# EAGLE design CB77-EI-Conversion-V1 (EAGLE 6.5.0)
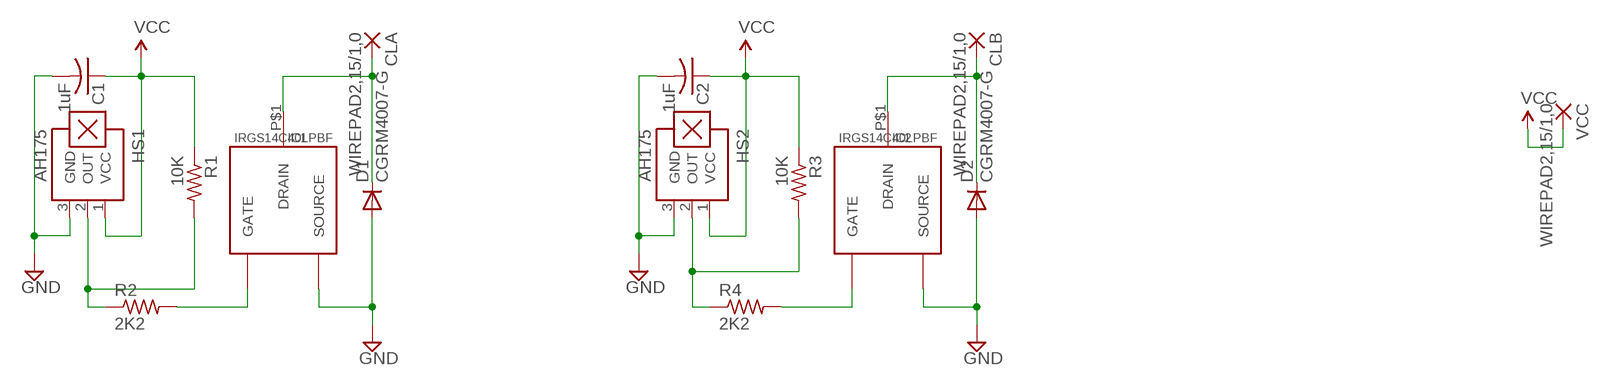
[diagram p0: schematic, sheet 1]

## Parts
C1  .1uF  C-USC0603K  [C0603K]
C2  .1uF  C-USC0603K  [C0603K]
CLA  WIREPAD2,15/1,0  [2,15/1,0]
CLB  WIREPAD2,15/1,0  [2,15/1,0]
D1  CGRM4007-G  [SOD-123_MINI-SMA]
D2  CGRM4007-G  [SOD-123_MINI-SMA]
HS1  AH175  A1301LH  [SOT23-W]
HS2  AH175  A1301LH  [SOT23-W]
IC1  IRGS14C40LPBF  [TO-263AB]
IC2  IRGS14C40LPBF  [TO-263AB]
R1  10K  R-US_R0603  [R0603]
R2  2K2  R-US_R0603  [R0603]
R3  10K  R-US_R0603  [R0603]
R4  2K2  R-US_R0603  [R0603]
VCC  WIREPAD2,15/1,0  [2,15/1,0]

## Nets
G1: IC1.P$2(GATE) R2.2
G2: IC2.P$2(GATE) R4.2
GND: C1.2 C2.2 D1.A D2.A HS1.3(GND) HS2.3(GND) IC1.P$3(SOURCE) IC2.P$3(SOURCE)
LHS: CLB.1(P) D2.C IC2.P$1(DRAIN)
N$3: HS1.2(OUT) R1.2 R2.1
N$8: HS2.2(OUT) R3.2 R4.1
RHS: CLA.1(P) D1.C IC1.P$1(DRAIN)
VCC: C1.1 C2.1 HS1.1(VCC) HS2.1(VCC) R1.1 R3.1 VCC.1(P)

## Library data of the parts
C1 C2 = adafruit:C-US: CAPACITOR, American symbol
CLA CLB VCC = wirepad:WIREPAD: Wire PAD connect wire on PCB
D1 D2 = diode:CGRM400*-G: Molded plasitc,JEDEC SOD-123/Mini SMA Source: Comchip CGRM4001-G.pdf
HS1 HS2 = allegro:A13*?: Linear Hall Effect Sensor ICs Continuous-Time Ratiometric High-Temperature Operation Programmable Linear with Analog Output A1302 -Replacement- UGN3503 Source: http://www.allegromicro.com/en/Products/Part_Numbers/1301/1301.pdf http://www.allegromicro.com/en/Products/Part_Numbers/1321/1321.pdf http://www.allegromicro.com/en/Products/Part_Numbers/1381/1381.pdf; MF: ALLEGRO MICROSYSTEMS, INC.; MPN: A1301ELHLT-T; OC_FARNELL: 1198084; OC_NEWARK: 31K6634
IC1 IC2 = My Library:IRGS14C40LPBF
R1-R4 = adafruit:R-US_: RESISTOR, American symbol

## Board
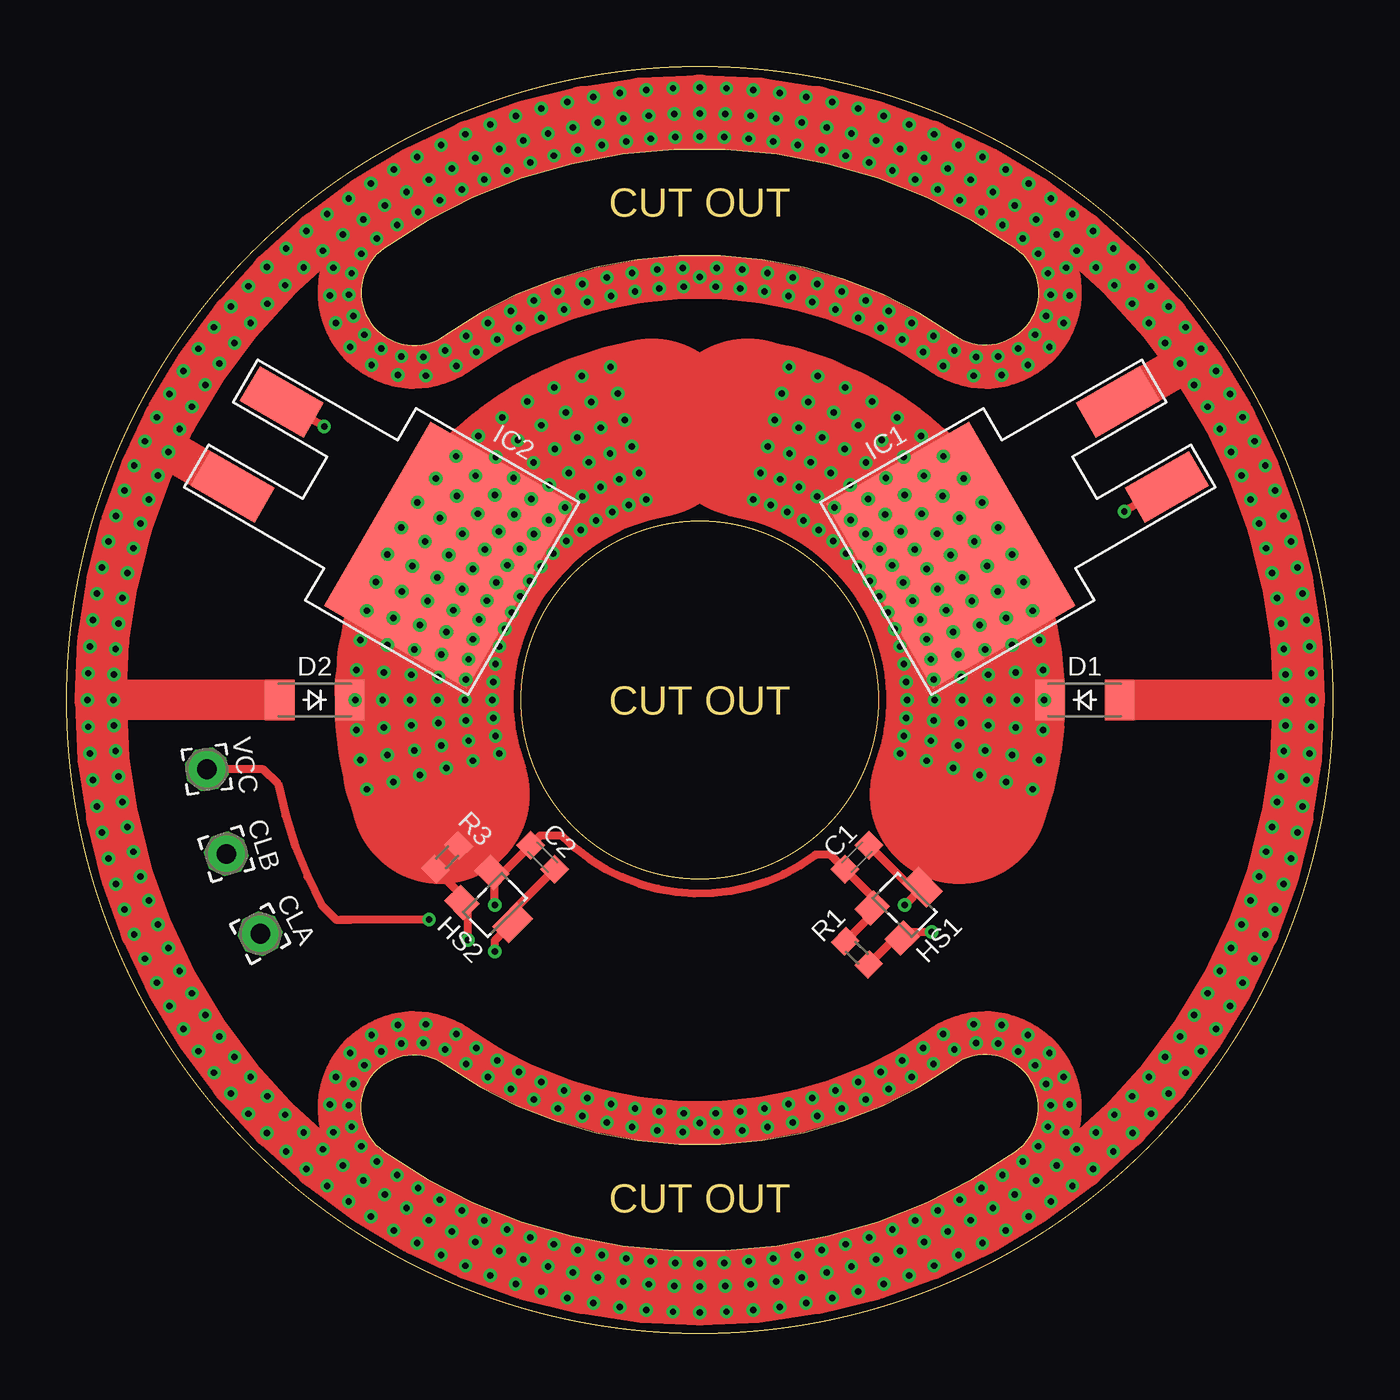
[diagram p1: board, top side]
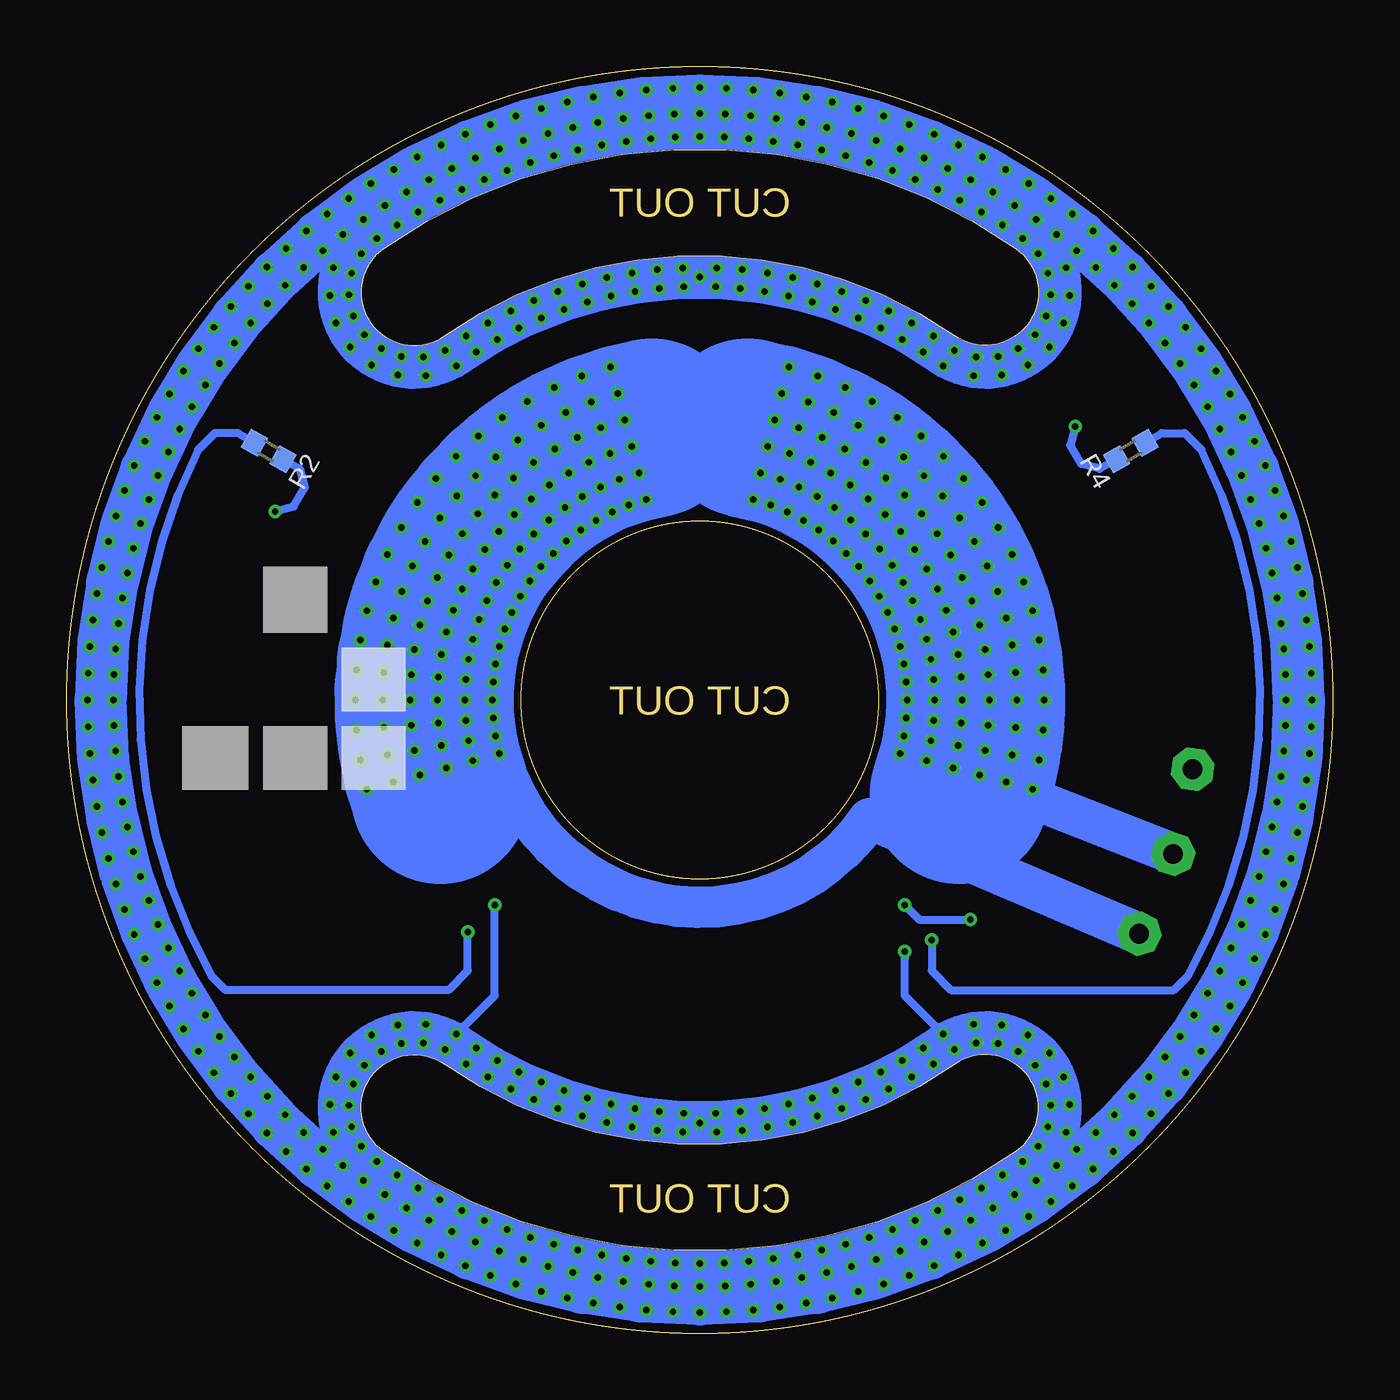
[diagram p2: board, bottom side, seen from below]

Size 65.5 x 65.5 mm. Coordinates in mm from the lower left corner, seen from the top.
Outline: 16.4,56.1 arc90 15.73,52.27 arc90 19.56,51.59 arc-70 45.94,51.59 arc90 49.77,52.27 arc90 49.1,56.1 arc70 16.4,56.1
Outline: 16.4,9.4 arc-90 15.73,13.23 arc-90 19.56,13.91 arc70 45.94,13.91 arc-90 49.77,13.23 arc-90 49.1,9.4 arc-70 16.4,9.4
Outline: circle at 32.75,32.75 radius 32.75
Outline: circle at 32.75,32.75 radius 9.25
Copper layers (1*16): Top 0.0356mm / dielectric 1.5011mm / Bottom 0.0356mm
Design rules "OSHPark8mildruTentedVias": minimum track width 8mil, minimum drill 13mil, track to track 8mil, track to pad 8mil, pad to pad 8mil, via to via 8mil, smd to smd 6mil, copper to edge 15mil, drill to drill 6mil, minimum pad ring 7mil, minimum via ring 7mil, stop-mask expansion 3mil, vias tented up to drill 16mil, thermal gap 10mil
tRestrict: area 27.8,53.5 to 37.8,63.5; area 27.8,2 to 37.8,12; area 30,4.2 to 35.5,9.8; area 30,55.8 to 35.5,61.2; area 6.2,22.7 to 10.3,26.9; area 7.9,18.6 to 12.1,22.7; 4 lines
bRestrict: 8 lines

### Footprints (pad centres in the part's own frame; a part is rotated, then mirrored left to right if it is on the bottom)
C0603K = smd 1.05 x 1.08: 1 -0.875,0; 2 0.875,0
2,15/1,0 = drill 1.016 pad 2.159 octagon: 1 0,0
SOD-123_MINI-SMA = smd 1.5 x 2.1: A 1.8,0; C -1.8,0
SOT23-W = smd 1.2 x 1.4: 1 -1.1,-1.3; 2 1.1,-1.3 | smd 1.8 x 1.2: 3 0,1.3
TO-263AB = smd 11 x 8.5: P$1 0,0 | smd 2.08 x 3.81: P$2 -2.54,-11.43; P$3 2.54,-11.43
R0603 = smd 1 x 1.1: 1 -0.85,0; 2 0.85,0

### Placement (x,y rotation side)
C1  40.88,24.62 45 top
C2  24.62,24.62 315 top
CLA  10.01,20.66 298 top
CLB  8.26,24.79 288 top
D1  52.67,32.75 0 top
D2  12.83,32.75 180 top
HS1  43.36,22.14 315 top
HS2  22.14,22.14 225 top
IC1  45.74,40.25 120 top
IC2  19.76,40.25 240 top
R1  40.88,19.67 315 top
R2  55.05,45.62 330 bottom
R3  19.67,24.62 225 top
R4  10.45,45.62 210 bottom
U$1  [GLIDER3]  53.75,33.88 0 bottom
VCC  7.25,29.17 278 top

### Tracks (layer width: path | path; a pad name or v marks a point on that pad's centre or on a via)
G1  (via drill 0.33)
  Top 0.406: IC1.P$2 v54.72,42.5
  Bottom 0.406: v54.72,42.5 53.75,42.76 53.19,43.73 53.45,44.7 R2.2
G2  (via drill 0.33)
  Top 0.406: IC2.P$2 v13.32,46.9
  Bottom 0.406: 12.05,44.7 R4.2 12.05,44.7 | 12.05,44.7 13.02,44.96 13.58,45.93 v13.32,46.9
GND  (via drill 0.33, 0.33 pad 0.69)
  Top 0.254: v8.69,14.29 v7.63,13.47 | v8.69,14.29 v9.52,13.25 | v9.52,13.25 v8.49,12.39 | v8.69,14.29 v7.9,15.35 | v7.9,15.35 v6.81,14.59 | v7.9,15.35 v7.17,16.45 | v7.17,16.45 v6.04,15.73 | v7.17,16.45 v6.48,17.58 | v6.48,17.58 v5.32,16.92 | v6.48,17.58 v5.84,18.74 | v5.84,18.74 v4.66,18.13 | v5.84,18.74 v5.26,19.93 | v5.26,19.93 v4.05,19.37 | v5.26,19.93 v4.73,21.14 | v4.73,21.14 v3.49,20.63 | v4.73,21.14 v4.25,22.38 | v4.25,22.38 v2.99,21.92 | v4.25,22.38 v3.82,23.63 | v3.82,23.63 v2.55,23.23 | v3.82,23.63 v3.45,24.9 | v3.45,24.9 v2.16,24.55 | v3.45,24.9 v3.14,26.18 | v3.14,26.18 v1.83,25.9 | v3.14,26.18 v2.88,27.48 | v2.88,27.48 v1.56,27.25 | v2.88,27.48 v2.68,28.79 | v2.68,28.79 v1.35,28.62 | v2.68,28.79 v2.53,30.11 | v2.53,30.11 v1.2,29.99 | v57.6,50.15 IC1.P$3 | v57.6,50.15 v56.81,51.22 | v57.6,50.15 v58.69,50.91 | v57.6,50.15 v58.33,49.05 | v58.33,49.05 v59.46,49.77 | v56.81,51.22 v57.87,52.03 | v60.18,48.58 v59.02,47.92 | v59.02,47.92 v59.66,46.76 | v59.66,46.76 v60.84,47.37 | v59.66,46.76 v60.24,45.57 | v60.24,45.57 v61.45,46.13 | v60.24,45.57 v60.77,44.36 | v60.77,44.36 v62.01,44.87 | v60.77,44.36 v61.25,43.12 | v61.25,43.12 v62.51,43.58 | v61.25,43.12 v61.68,41.87 61.75,41.75 | 61.75,41.75 v62.05,40.6 | v62.05,40.6 v63.34,40.95 | v62.05,40.6 v62.36,39.31 | v62.36,39.31 v63.67,39.6 | v62.36,39.31 v62.62,38.02 | v62.62,38.02 v63.94,38.25 | v62.62,38.02 v62.82,36.71 | v62.82,36.71 v64.15,36.88 | v62.82,36.71 v62.97,35.39 | v62.97,35.39 v64.3,35.51 | v62.97,35.39 v63.05,34.07 | v63.05,34.07 v64.39,34.13 | v63.05,34.07 v63.08,32.75 | v63.08,32.75 v63.05,31.43 | v63.05,31.43 63.73,31.4 v64.39,31.37 | v63.05,31.43 v62.97,30.11 | v62.97,30.11 v64.3,29.99 | v62.97,30.11 v62.82,28.79
  Top 0.254: v62.82,28.79 v64.15,28.62 | v62.82,28.79 v62.62,27.48 | v62.62,27.48 v63.94,27.25 | v62.62,27.48 v62.36,26.18 | v62.36,26.18 v63.67,25.9 | v62.36,26.18 v62.05,24.9 | v62.05,24.9 v63.34,24.55 | v62.05,24.9 v61.68,23.63 | v61.68,23.63 v62.95,23.23 | v61.68,23.63 v61.25,22.38 | v61.25,22.38 v62.51,21.92 | v61.25,22.38 v60.77,21.14 | v60.77,21.14 v62.01,20.63 | v60.77,21.14 v60.24,19.93 | v60.24,19.93 v61.45,19.37 | v60.24,19.93 v59.66,18.74 | v59.66,18.74 v60.84,18.13 | v59.66,18.74 v59.02,17.58 | v59.02,17.58 v60.18,16.92 | v59.02,17.58 v58.33,16.45 | v58.33,16.45 v59.46,15.73 | v58.33,16.45 v57.6,15.35 | v57.6,15.35 v58.69,14.59 | v57.6,15.35 v56.81,14.29 | v56.81,14.29 v57.87,13.47 | v56.81,14.29 v55.98,13.25 | v55.98,13.25 v57.01,12.39 | v55.11,12.26 v56.1,11.36 | v55.11,12.26 v55.98,13.25 | v9.52,13.25 v10.39,12.26 | v14.29,8.69 v15.35,7.9 | v15.35,7.9 v16.45,7.17 | v12.26,10.39 v11.36,9.4 | v13.25,9.52 v12.39,8.49 | v15.35,7.9 v14.59,6.81 | v16.45,7.17 v17.58,6.48 | v17.58,6.48 v16.92,5.32 | v17.58,6.48 v18.74,5.84 | v18.74,5.84 v18.13,4.66 | v18.74,5.84 v19.93,5.26 | v19.93,5.26 v19.37,4.05 | v19.93,5.26 v21.14,4.73 | v21.14,4.73 v20.63,3.49 | v21.14,4.73 v22.38,4.25 | v22.38,4.25 v21.92,2.99 | v23.63,3.82 v22.38,4.25 | v23.63,3.82 v23.23,2.55 | v23.63,3.82 v24.9,3.45 | v24.9,3.45 v24.55,2.16 | v24.9,3.45 v26.18,3.14 | v26.18,3.14 v25.9,1.83 | v26.18,3.14 v27.48,2.88 | v27.48,2.88 v27.25,1.56 | v27.48,2.88 v28.79,2.68 | v28.79,2.68 v28.62,1.35 | v28.79,2.68 v30.11,2.53 | v30.11,2.53 v29.99,1.2 | v30.11,2.53 v31.43,2.45 | v31.43,2.45 v31.37,1.11 | v34.07,2.45 v34.13,1.11 | v34.07,2.45 v35.39,2.53 | v35.39,2.53 v35.51,1.2 | v35.39,2.53 v36.71,2.68 | v36.71,2.68 v36.88,1.35
  Top 0.254: v36.71,2.68 v38.02,2.88 | v38.02,2.88 v38.25,1.56 | v38.02,2.88 v39.31,3.14 | v39.31,3.14 v39.6,1.83 | v39.31,3.14 v40.6,3.45 | v40.6,3.45 v41.87,3.82 | v41.87,3.82 v42.27,2.55 | v41.87,3.82 v43.12,4.25 | v43.12,4.25 v43.58,2.99 | v43.12,4.25 v44.36,4.73 | v44.36,4.73 v44.87,3.49 | v44.36,4.73 v45.57,5.26 | v45.57,5.26 v46.76,5.84 | v46.76,5.84 v47.37,4.66 | v46.76,5.84 v47.92,6.48 | v47.92,6.48 v48.58,5.32 | v47.92,6.48 v49.05,7.17 | v49.05,7.17 v49.77,6.04 | v49.05,7.17 v50.15,7.9 | v50.15,7.9 v50.91,6.81 | v50.15,7.9 v51.22,8.69 | v51.22,8.69 v52.03,7.63 | v51.22,8.69 v52.25,9.52 | v52.25,9.52 v53.11,8.49 | v53.24,10.39 v52.25,9.52 | v53.24,10.39 v54.2,11.3 | v2.45,31.43 v2.53,30.11 | v2.45,31.43 v1.11,31.37 | v2.45,34.07 v2.42,32.75 | v2.45,34.07 v1.11,34.13 | v2.53,35.39 v2.45,34.07 | v2.53,35.39 v1.2,35.51 | v2.68,36.71 v2.53,35.39 | v2.68,36.71 v1.35,36.88 | v2.88,38.02 v2.68,36.71 | v2.88,38.02 v1.56,38.25 | v3.14,39.31 v2.88,38.02 | v3.14,39.31 v1.83,39.6 | v3.45,40.6 v3.14,39.31 | v3.45,40.6 v2.16,40.95 | v3.82,41.87 v3.45,40.6 | v3.82,41.87 v2.55,42.27 | v4.25,43.12 v3.82,41.87 | v4.25,43.12 v2.99,43.58 | v4.25,43.12 v4.73,44.36 | v4.73,44.36 v3.49,44.87 | v5.26,45.57 v4.73,44.36 | v5.26,45.57 v4.05,46.13 | v5.84,46.76 v5.26,45.57 | v5.84,46.76 v4.66,47.37 | v6.48,47.92 v5.84,46.76 | v6.48,47.92 v5.32,48.58 | v7.17,49.05 v6.48,47.92 | v7.17,49.05 v6.04,49.77 | v7.9,50.15 v7.17,49.05 | v7.9,50.15 v6.81,50.91 | v8.69,51.22 v7.9,50.15 | v8.69,51.22 v7.63,52.03 | v9.52,52.25 v8.69,51.22 | v9.52,52.25 v8.49,53.11 | v10.39,53.24 v9.52,52.25 | v10.39,53.24 v9.4,54.14 | v11.3,54.2 v10.39,53.24 | v11.3,54.2 v10.36,55.14 | v12.26,55.11 v11.3,54.2 | v12.26,55.11 v11.36,56.1
  Top 0.254: v13.25,55.98 v12.26,55.11 | v13.25,55.98 v12.39,57.01 | v14.29,56.81 v13.25,55.98 | v14.29,56.81 v13.47,57.87 | v15.35,57.6 v14.29,56.81 | v15.35,57.6 v14.59,58.69 | v16.45,58.33 v15.35,57.6 | v16.45,58.33 v15.73,59.46 | v17.58,59.02 v16.45,58.33 | v17.58,59.02 v16.92,60.18 | v18.74,59.66 v17.58,59.02 | v18.74,59.66 v18.13,60.84 | v19.93,60.24 v18.74,59.66 | v19.93,60.24 v19.37,61.45 | v21.14,60.77 v19.93,60.24 | v21.14,60.77 v20.63,62.01 | v22.38,61.25 v21.14,60.77 | v22.38,61.25 v21.92,62.51 | v23.63,61.68 v22.38,61.25 | v23.63,61.68 v23.23,62.95 | v24.9,62.05 v23.63,61.68 | v24.9,62.05 v24.55,63.34 | v26.18,62.36 v24.9,62.05 | v26.18,62.36 v25.9,63.67 | v27.48,62.62 v26.18,62.36 | v27.48,62.62 v27.25,63.94 | v28.79,62.82 v27.48,62.62 | v28.79,62.82 v28.62,64.15 | v30.11,62.97 v28.79,62.82 | v30.11,62.97 v29.99,64.3 | v31.43,63.05 v30.11,62.97 | v31.43,63.05 v31.37,64.39 | v32.75,63.08 v31.43,63.05 | v32.75,63.08 v32.75,64.42 | v34.07,63.05 v32.75,63.08 | v34.07,63.05 v34.13,64.39 | v35.39,62.97 v34.07,63.05 | v35.39,62.97 v35.51,64.3 | v36.71,62.82 v35.39,62.97 | v36.71,62.82 v36.88,64.15 | v38.02,62.62 v36.71,62.82 | v38.02,62.62 v38.25,63.94 | v39.31,62.36 v38.02,62.62 | v39.31,62.36 v39.6,63.67 | v40.6,62.05 v39.31,62.36 | v40.6,62.05 v40.95,63.34 | v41.87,61.68 v40.6,62.05 | v41.87,61.68 v42.27,62.95 | v43.12,61.25 v41.87,61.68 | v43.12,61.25 v43.58,62.51 | v44.36,60.77 v43.12,61.25 | v44.36,60.77 v44.87,62.01 | v45.57,60.24 v44.36,60.77 | v45.57,60.24 v46.13,61.45 | v46.76,59.66 v45.57,60.24 | v46.76,59.66 v47.37,60.84 | v47.92,59.02 v46.76,59.66 | v47.92,59.02 v48.58,60.18 | v49.05,58.33 v47.92,59.02 | v49.05,58.33 v49.77,59.46 | v50.15,57.6 v49.05,58.33
  Top 0.254: v50.15,57.6 v50.91,58.69 | v51.22,56.81 v50.15,57.6 | v52.03,57.87 v51.22,56.81 | v52.25,55.98 v51.22,56.81 | v52.25,55.98 v53.11,57.01 | v53.24,55.11 v52.25,55.98 | v53.24,55.11 v54.14,56.1 | v54.2,54.2 v53.24,55.11 | v54.2,54.2 v55.14,55.14 | v55.11,53.24 v54.2,54.2 | v55.11,53.24 v56.1,54.14 | v55.98,52.25 v55.11,53.24 | v55.98,52.25 v57.01,53.11 | v59.02,47.92 v58.33,49.05 | IC2.P$3 v5.26,45.57 | v2.42,32.75 1.75,32.75 | 10.5,32.75 D2.A | 63.75,32.75 v63.08,32.75 | v2.45,31.43 v2.42,32.75 | v2.42,32.75 1.75,32.75 | 1.75,32.75 v1.08,32.75 | v14.29,8.69 v13.25,9.52 | v14.29,8.69 v13.47,7.63 | v13.25,9.52 v12.26,10.39 | v12.26,10.39 v11.3,11.3 | v11.3,11.3 v10.39,12.26 | v11.3,11.3 v10.36,10.36 | v10.39,12.26 v9.4,11.36 | v53.24,10.39 v54.14,9.4 | v54.2,11.3 v55.14,10.36 | v45.57,5.26 v46.13,4.05 | v31.43,63.05 v31.48,61.86 | v32.75,63.08 v32.75,61.89 | v34.07,63.05 v34.02,61.86 | v30.11,62.97 v30.21,61.77 | v28.79,62.82 v28.95,61.64 | v35.39,62.97 v35.29,61.77 | v36.71,62.82 v36.55,61.64 | v38.02,62.62 v37.81,61.44 | v39.31,62.36 v39.06,61.2 | v40.6,62.05 v40.29,60.89 | v41.87,61.68 v41.51,60.54 | v43.12,61.25 v42.72,60.13 | v44.36,60.77 v43.9,59.67 | v45.57,60.24 v45.06,59.16 | v46.76,59.66 v46.2,58.59 | v47.92,59.02 v47.32,57.98 | v49.05,58.33 v48.41,57.32 v49.46,56.62 | v27.48,62.62 v27.69,61.44 | v26.18,62.36 v26.44,61.2 | v24.9,62.05 v25.21,60.89 | v23.63,61.68 v23.99,60.54 | v22.38,61.25 v22.79,60.13 | v21.14,60.77 v21.6,59.67 | v19.93,60.24 v20.44,59.16 | v18.74,59.66 v19.3,58.59 | v17.58,59.02 v18.18,57.98 | v16.45,58.33 v17.09,57.32 v16.04,56.62 v15.24,55.83 v14.74,54.82 | v13.8,55.1 v14.74,54.82 | v14.74,54.82 v14.6,53.7 | v14.6,53.7 v13.62,53.66
  Top 0.254: v14.83,52.61 v14.6,53.7 | v14.83,52.61 v13.92,52.25 | v15.41,51.64 v14.66,51 | v15.41,51.64 v14.83,52.61 | v16.27,50.92 v15.41,51.64 | v17.32,50.52 v16.27,50.92 | v18.45,50.49 v17.32,50.52 | v19.57,50.82 v18.45,50.49 | v20.66,51.57 v19.57,50.82 | v21.8,52.25 v20.66,51.57 | v22.97,52.86 v21.8,52.25 | v24.17,53.4 v22.97,52.86 | v25.41,53.87 v24.17,53.4 | v26.67,54.27 v25.41,53.87 | v27.95,54.59 v26.67,54.27 | v29.25,54.84 v27.95,54.59 | v30.56,55.01 v29.25,54.84 | v31.88,55.1 v30.56,55.01 | v34.94,55.01 v36.25,54.84 | v36.25,54.84 v37.55,54.59 | v37.55,54.59 v38.83,54.27 | v38.83,54.27 v40.09,53.87 | v40.09,53.87 v41.33,53.4 | v41.33,53.4 v42.53,52.86 | v42.53,52.86 v43.7,52.25 | v43.7,52.25 v44.84,51.57 | v47.05,50.49 v48.18,50.52 | v48.18,50.52 v49.23,50.92 | v49.23,50.92 v50.09,51.64 | v50.67,52.61 v50.9,53.7 | v50.9,53.7 v50.76,54.82 | v50.76,54.82 v50.26,55.83 v49.46,56.62 | v50.76,54.82 v51.7,55.1 | v50.9,53.7 v51.88,53.66 | v50.67,52.61 v51.58,52.25 | v49.23,50.92 v49.72,50.08 | v48.18,50.52 v48.37,49.56 | v47.05,50.49 v46.92,49.52 | v43.7,52.25 v43.23,51.39 | v42.53,52.86 v42.11,51.98 | v41.33,53.4 v40.95,52.5 | v40.09,53.87 v39.77,52.95 | v38.83,54.27 v38.57,53.33 | v37.55,54.59 v37.34,53.64 | v36.25,54.84 v36.1,53.87 | v34.94,55.01 v34.85,54.03 | v33.62,55.1 v33.59,54.12 | v30.56,55.01 v30.65,54.03 | v29.25,54.84 v29.4,53.87 | v27.95,54.59 v28.16,53.64 | v26.67,54.27 v26.93,53.33 | v25.41,53.87 v25.73,52.95 | v24.17,53.4 v24.55,52.5 | v22.97,52.86 v23.39,51.98 | v21.8,52.25 v22.27,51.39 | v18.45,50.49 v18.58,49.52 | v17.32,50.52 v17.13,49.56 | v16.27,50.92 v15.78,50.08 | v45.93,50.82 v47.05,50.49 | v45.93,50.82 v44.84,51.57 | v45.93,50.82 v45.35,50.03
  Top 0.254: v44.84,51.57 v44.31,50.74 | v34.94,55.01 v33.62,55.1 | v31.88,55.1 32.75,55.1 | 32.75,55.1 v33.62,55.1 | v31.88,55.1 v31.91,54.12 | v32.75,54.62 32.75,55.1 | v50.09,51.64 v50.84,51 | v50.09,51.64 v50.67,52.61 | v63.08,32.75 63.75,32.75 | 63.75,32.75 v64.42,32.75 | v54.2,11.3 v55.11,12.26 | v55.98,52.25 v56.81,51.22 | v19.57,50.82 v20.15,50.03 | v20.66,51.57 v21.19,50.74 | v15.73,6.04 v16.45,7.17 | v40.6,3.45 v40.95,2.16 | v49.46,56.62 49.74,57.02 v49.46,56.62 | v49.05,7.17 v48.41,8.18 v49.46,8.88 v50.26,9.67 v50.76,10.68 | v47.92,6.48 v47.32,7.52 | v46.76,5.84 v46.2,6.91 | v45.57,5.26 v45.06,6.34 | v44.36,4.73 v43.9,5.83 | v43.12,4.25 v42.72,5.37 | v41.87,3.82 v41.51,4.96 | v40.6,3.45 v40.29,4.61 | v39.31,3.14 v39.06,4.3 | v38.02,2.88 v37.81,4.06 | v16.45,7.17 v17.09,8.18 v16.04,8.88 | v18.18,7.52 v17.58,6.48 | v18.74,5.84 v19.3,6.91 | v19.93,5.26 v20.44,6.34 | v21.14,4.73 v21.6,5.83 | v22.38,4.25 v22.79,5.37 | v23.63,3.82 v23.99,4.96 | v24.9,3.45 v25.21,4.61 | v26.18,3.14 v26.44,4.3 | v27.48,2.88 v27.69,4.06 | v28.79,2.68 v28.95,3.86 | v30.11,2.53 v30.21,3.73 | v31.43,2.45 v31.48,3.64 | v32.75,2.42 v31.43,2.45 | v32.75,2.42 v34.07,2.45 | v32.75,1.08 v32.75,2.42 | v32.75,2.42 v32.75,3.61 | v34.07,2.45 v34.02,3.64 | v35.39,2.53 v35.29,3.73 | v36.71,2.68 v36.55,3.86 | v16.04,8.88 v15.24,9.67 v14.74,10.68 | v14.74,10.68 v13.8,10.4 | v14.74,10.68 v14.6,11.8 | v14.6,11.8 v14.83,12.89 | v14.83,12.89 v15.41,13.86 | v15.41,13.86 v16.27,14.58 | v16.27,14.58 v17.32,14.98 | v17.32,14.98 v18.45,15.01 | v18.45,15.01 v19.57,14.68 | v19.57,14.68 v20.66,13.93 | v20.66,13.93 v21.8,13.25 | v21.8,13.25 v22.97,12.64 | v22.97,12.64 v24.17,12.1 | v24.17,12.1 v25.41,11.63 | v26.67,11.23 v25.41,11.63
  Top 0.254: v26.67,11.23 v27.95,10.91 | v27.95,10.91 v29.25,10.66 | v29.25,10.66 v30.56,10.49 | v30.56,10.49 v31.88,10.4 | v31.88,10.4 32.75,10.4 | 32.75,10.4 v33.62,10.4 | v32.75,10.88 32.75,10.4 | v34.94,10.49 v33.62,10.4 | v36.25,10.66 v34.94,10.49 | v36.25,10.66 v37.55,10.91 | v38.83,11.23 v37.55,10.91 | v38.83,11.23 v40.09,11.63 | v40.09,11.63 v41.33,12.1 | v41.33,12.1 v42.53,12.64 | v42.53,12.64 v43.7,13.25 | v43.7,13.25 v44.84,13.93 | v44.84,13.93 v45.93,14.68 | v45.93,14.68 v47.05,15.01 | v47.05,15.01 v48.18,14.98 | v48.18,14.98 v49.23,14.58 | v49.23,14.58 v50.09,13.86 | v50.09,13.86 v50.67,12.89 | v50.67,12.89 v50.9,11.8 | v50.9,11.8 v50.76,10.68 | v50.76,10.68 v51.7,10.4 | v50.9,11.8 v51.88,11.84 | v50.67,12.89 v51.58,13.25 | v50.09,13.86 v50.84,14.5 | v49.23,14.58 v49.72,15.42 | v48.18,14.98 v48.37,15.94 | v47.05,15.01 v46.92,15.98 | v45.93,14.68 v45.35,15.47 | v44.84,13.93 v44.31,14.76 | v43.7,13.25 v43.23,14.11 | v42.53,12.64 v42.11,13.52 | v41.33,12.1 v40.95,13 | v40.09,11.63 v39.77,12.55 | v38.83,11.23 v38.57,12.17 | v37.55,10.91 v37.34,11.86 | v36.25,10.66 v36.1,11.63 | v34.94,10.49 v34.85,11.47 | v30.56,10.49 v30.65,11.47 | v29.25,10.66 v29.4,11.63 | v27.95,10.91 v28.16,11.86 | v26.67,11.23 v26.93,12.17 | v25.41,11.63 v25.73,12.55 | v24.17,12.1 v24.55,13 | v22.97,12.64 v23.39,13.52 | v21.8,13.25 v22.27,14.11 | v20.66,13.93 v21.19,14.76 | v19.57,14.68 v20.15,15.47 | v18.45,15.01 v18.58,15.98 | v17.32,14.98 v17.13,15.94 | v16.27,14.58 v15.78,15.42 | v15.41,13.86 v14.66,14.5 | v14.83,12.89 v13.92,13.25 | v14.6,11.8 v13.62,11.84 | v31.91,11.38 v31.88,10.4 | v33.59,11.38 v33.62,10.4 | v16.04,8.88 15.76,8.48 v16.04,8.88 | 61.75,41.75 v62.95,42.27
  Top 0.406: D1.A 55,32.75 | C2.2 23.06,21.82 HS2.3 22.14,20.3 v22.14,19.75 | C1.2 43.67,23.06 HS1.3 v43.36,22.14
  Top 2.08: IC2.P$3 5.13,45.77 | IC1.P$3 57.83,50.16
  Top 2.1: 55,32.75 v63.08,32.75 63.75,32.75 | 10.5,32.75 v2.42,32.75 1.75,32.75
  Top 2.25: 45.3,50.67 arc70 20.2,50.67 arc-90 14.81,51.62 arc-90 15.76,57.02 arc-70 49.74,57.02 arc-90 50.69,51.62 arc-90 45.3,50.67 | 15.76,8.48 arc70 49.74,8.48 arc90 50.69,13.88 arc90 45.3,14.83 arc-70 20.2,14.83 arc90 14.81,13.88 arc90 15.76,8.48
  Top 2.7: 1.75,32.75 arc180 63.75,32.75 arc180 1.75,32.75
  Bottom 0.254: v16.04,8.88 15.76,8.48 v17.09,8.18 | 1.75,32.75 v2.42,32.75 | 49.74,57.02 v49.46,56.62 49.74,57.02
  Bottom 0.406: v45.35,15.47 43.36,17.46 v43.36,22.14 | v20.15,15.47 22.14,17.46 22.14,19.34 v22.14,19.75
  Bottom 2.25: 45.3,50.67 arc70 20.2,50.67 arc-90 14.81,51.62 arc-90 15.76,57.02 arc-70 49.74,57.02 arc-90 50.69,51.62 arc-90 45.3,50.67 | 15.76,8.48 arc70 49.74,8.48 arc90 50.69,13.88 arc90 45.3,14.83 arc-70 20.2,14.83 arc90 14.81,13.88 arc90 15.76,8.48
  Bottom 2.7: 1.75,32.75 arc-180 63.75,32.75 arc-180 1.75,32.75
LHS  (via drill 0.33 pad 0.69)
  Top 0: 19.34,27.87 D2.C IC2.P$1 | 19.34,27.87 v19.65,29.24 | 19.34,27.87 v18.28,28.87 v17.99,30.15 17.75,31.75 | v19.65,29.24 v19.39,30.39 v19.24,31.57 | v19.65,29.24 v21.02,29.61 v20.79,30.64 | v20.79,30.64 v22.19,30.89 | v22.19,30.89 v22.39,29.97 | v22.19,30.89 v22.06,31.82 | v20.65,31.69 20.75,31.75 | v20.79,30.64 20.75,30.75 v20.65,31.69 | v19.24,31.57 v17.82,31.44 v16.41,31.32 | v19.24,31.57 v20.65,31.69 | v16.41,31.32 v16.59,29.9 v15.2,29.66 | v14.99,31.2 v16.41,31.32
  Top 0.254: 20.75,31.75 v20.6,32.75 v20.65,33.81 v20.79,34.86 v21.02,35.89 v21.34,36.9 v21.74,37.88 v22.23,38.82 v22.8,39.72 v23.45,40.56 v24.16,41.34 v24.94,42.05 v25.78,42.7 v26.68,43.27 v27.62,43.76 v28.6,44.16 v29.61,44.48 | v22.06,31.82 v22.02,32.75 v22.06,33.69 v22.19,34.61 v22.39,35.53 v22.67,36.42 v23.03,37.28 v23.46,38.11 v23.96,38.9 v24.53,39.64 v25.16,40.34 v25.86,40.97 v26.6,41.54 v27.39,42.04 v28.22,42.47 v29.08,42.83 v29.97,43.11 | v19.24,31.57 v19.19,32.75 v19.24,33.93 v19.39,35.11 v19.65,36.26 v20,37.39 v20.46,38.48 v21,39.53 v21.64,40.53 v22.36,41.47 v23.16,42.34 v24.03,43.14 v24.97,43.86 v25.97,44.5 v27.02,45.04 v28.11,45.5 v29.24,45.85 | 17.75,31.75 v17.77,32.75 v17.82,34.06 v17.99,35.35 | D2.C v14.93,32.75 v16.35,32.75 v16.41,34.18 v14.99,34.3 | v17.99,35.35 v16.59,35.6 | v16.59,35.6 v15.2,35.84 | v15.53,37.36 v16.91,37 v16.59,35.6 | v17.99,35.35 v18.28,36.63 v18.67,37.88 v17.34,38.36 v16,38.85 | v16.6,40.28 v17.88,39.68 v19.17,39.08 IC2.P$1 | IC2.P$1 v18.54,40.95 | v18.54,40.95 v17.31,41.66 | v18.54,40.95 v19.31,42.16 | v19.31,42.16 v20.18,43.29 v19.1,44.21 | v19.31,42.16 v18.15,42.97 | v22.15,43.35 v21.27,42.38 v20.48,41.34 v19.77,40.24 IC2.P$1 | v22.15,43.35 v21.15,44.35 | v21.15,44.35 v20.15,45.35 | v22.15,43.35 v23.12,44.23 v24.16,45.02 | v21.15,44.35 v22.21,45.32 v21.29,46.4 | v24.16,45.02 v25.26,45.73 | v25.26,45.73 v26.42,46.33 | v26.42,46.33 v27.62,46.83 | v27.62,46.83 v28.87,47.22 v28.5,48.59 v28.14,49.97 | v27.62,46.83 v27.14,48.16 v26.65,49.5 | v26.42,46.33 v25.82,47.62 v25.22,48.9 | v25.26,45.73 v24.55,46.96 v23.84,48.19 | v24.16,45.02 v23.34,46.19 v22.53,47.35
  Top 9.25: 30.27,46.81 arc100 19.34,27.87
  Bottom 0: CLB.1 19.34,27.87 v16.91,28.5 | v18.28,28.87 v16.91,28.5 | v16.91,28.5 v15.53,28.14
  Bottom 2.15: CLB.1 21.41,29.95
  Bottom 9.25: 30.27,46.81 arc100 19.34,27.87
N$3  (via drill 0.33)
  Top 0.406: R1.2 42.86,20.45 HS1.2 43.52,20.75 v44.75,20.75
  Bottom 0.406: v44.75,20.75 44.75,18.75 45.75,17.75 57.27,17.75 57.99,18.47 arc56 58.7,45.69 57.84,46.55 56.65,46.55 R2.1
N$8  (via drill 0.33)
  Top 0.406: R3.2 20.45,22.64 HS2.2 20.75,21.98 v20.75,20.34
  Bottom 0.406: v20.75,20.34 20.75,18.75 19.75,17.75 8.23,17.75 7.51,18.47 arc-56 6.8,45.69 7.66,46.55 8.85,46.55 R4.1
RHS  (via drill 0.33 pad 0.69)
  Top 0: D1.C IC1.P$1 | 46.89,28.62 46.16,27.87 v45.85,29.24 v46.11,30.39 v46.26,31.57 v44.85,31.69 | v50.3,29.66 v48.91,29.9 v48.59,28.5 v49.97,28.14 | v47.51,30.15 v47.68,31.44 v49.09,31.32 v50.51,31.2 | v44.85,31.69 v44.71,30.64 v44.48,29.61 | v44.85,31.69 v43.44,31.82 | v43.44,31.82 v43.31,30.89 v43.11,29.97 | v43.48,32.75 v43.44,31.82
  Top 0.203: D1.C 46.89,28.62 v47.51,30.15
  Top 0.254: v43.48,32.75 | v43.48,32.75 44.75,32.75 | v44.9,32.75 44.85,32.75 | 44.75,32.75 44.75,31.75 46.31,31.75 v46.31,32.75 | v46.31,32.75 v47.73,32.75 47.68,32.75 v47.68,34.06 | v49.09,31.32 49.15,31.32 v49.15,32.75 | v47.68,34.06 49.09,34.06 v49.09,34.18 49.09,34.3 | v50.51,34.3 49.09,34.3 | v47.68,34.06 47.51,34.06 v47.51,35.35 | 49.09,34.3 48.91,34.3 v48.91,35.6 | v48.91,35.6 50.3,35.6 v50.3,35.84 | v48.91,35.6 48.59,35.6 v48.59,37 49.97,37 v49.97,37.36 | v46.31,32.75 46.26,32.75 v46.26,33.93 46.11,33.93 v46.11,35.11 45.85,35.11 v45.85,36.26 45.5,36.26 v45.5,37.39 v45.04,38.48 v44.5,39.53 v43.86,40.53 v43.14,41.47 v42.34,42.34 v41.47,43.14 v40.53,43.86 v39.53,44.5 v38.48,45.04 v37.39,45.5 v36.26,45.85 | 44.75,32.75 44.85,32.75 | 44.85,32.75 v44.85,33.81 44.71,33.81 v44.71,34.86 44.48,34.86 v44.48,35.89 44.16,35.89 v44.16,36.9 v43.76,37.88 v43.27,38.82 v42.7,39.72 v42.05,40.56 v41.34,41.34 v40.56,42.05 v39.72,42.7 v38.82,43.27 v37.88,43.76 v36.9,44.16 v35.89,44.48 | v43.48,32.75 43.44,32.75 v43.44,33.69 43.31,33.69 v43.31,34.61 43.11,34.61 v43.11,35.53 42.83,35.53 v42.83,36.42 v42.47,37.28 v42.04,38.11 v41.54,38.9 v40.97,39.64 v40.34,40.34 v39.64,40.97 v38.9,41.54 v38.11,42.04 v37.28,42.47 v36.42,42.83 v35.53,43.11 | v47.22,36.63 v46.83,37.88 | v49.5,38.85 v48.16,38.36 v46.83,37.88 | v46.83,37.88 v46.33,39.08 | v46.33,39.08 v47.62,39.68 v48.9,40.28 | v46.33,39.08 IC1.P$1 | v46.96,40.95 v48.19,41.66 | IC1.P$1 v45.02,41.34 | v45.02,41.34 v46.19,42.16 v47.35,42.97 | v45.02,41.34 v44.23,42.38 v43.35,43.35 | v43.35,43.35 v44.35,44.35 | v44.35,44.35 v45.32,43.29 v46.4,44.21
  Top 0.254: v44.35,44.35 v45.35,45.35 | v43.35,43.35 v42.38,44.23 | v42.38,44.23 v43.29,45.32 v44.21,46.4 | v42.97,47.35 v42.16,46.19 v40.95,46.96 | v42.38,44.23 v41.34,45.02 v40.24,45.73 | v40.24,45.73 v39.08,46.33 v37.88,46.83 | v37.88,46.83 v38.36,48.16 | v37.88,46.83 v36.63,47.22 | v37.36,49.97 v37,48.59 v38.36,48.16 | v38.36,48.16 v38.85,49.5 | v40.28,48.9 39.75,47.75 v39.68,47.62 v40.95,46.96 | v40.95,46.96 v40.24,45.73 | v40.95,46.96 v41.66,48.19 | v45.73,40.24 IC1.P$1
  Top 0.406: v46.96,40.95 IC1.P$1
  Top 9.25: 35.23,46.81 arc-100 46.16,27.87
  Bottom 0: 46.16,27.87 v47.22,28.87 | v43.48,32.75 v43.44,31.82
  Bottom 0.203: v48.59,28.5 v47.22,28.87 v47.51,30.15 | v50.57,32.75 D1.C v50.51,31.2
  Bottom 2.15: v43.48,32.75 arc-145 23.96,26.6 CLA.1
  Bottom 9.25: 35.23,46.81 arc-100 46.16,27.87
VCC  (via drill 0.33)
  Top 0.254: 22.6,23.84 HS2.1 21.65,23.84 | 41.66,22.6 HS1.1 41.66,21.65 | 25.65,25.71 arc82 38.73,24.74 38.75,24.75 | 25.62,25.74 25.61,25.75
  Top 0.406: 22.6,23.84 C2.1 24.51,25.75 25.61,25.75 | 41.66,22.6 C1.1 39.51,24.75 38.75,24.75 | R3.1 21.65,23.84 | R1.1 41.66,21.65 | 25.62,25.74 arc82 38.73,24.74 | v22.14,22.14 22.14,23.7 HS2.1 | v18.75,21.39 16.75,21.39 14.75,21.39 | 14.75,21.39 14.21,21.39 | 14.75,21.39 13.94,21.39 13.2,22.13 arc-17 10.93,28.41 10.17,29.17 VCC.1
  Bottom 0.406: v18.75,21.39 21.39,21.39 v22.14,22.14

### Text on the board
Dimension: CUT OUT | CUT OUT | CUT OUT